# Altium project AMC_FMC_Carrier v3.PrjPcb (part 2 of 15)

## Sheet FPGA.SchDoc
size A3; DocumentNumber: 4; SheetNumber: 4; SheetTotal: 30
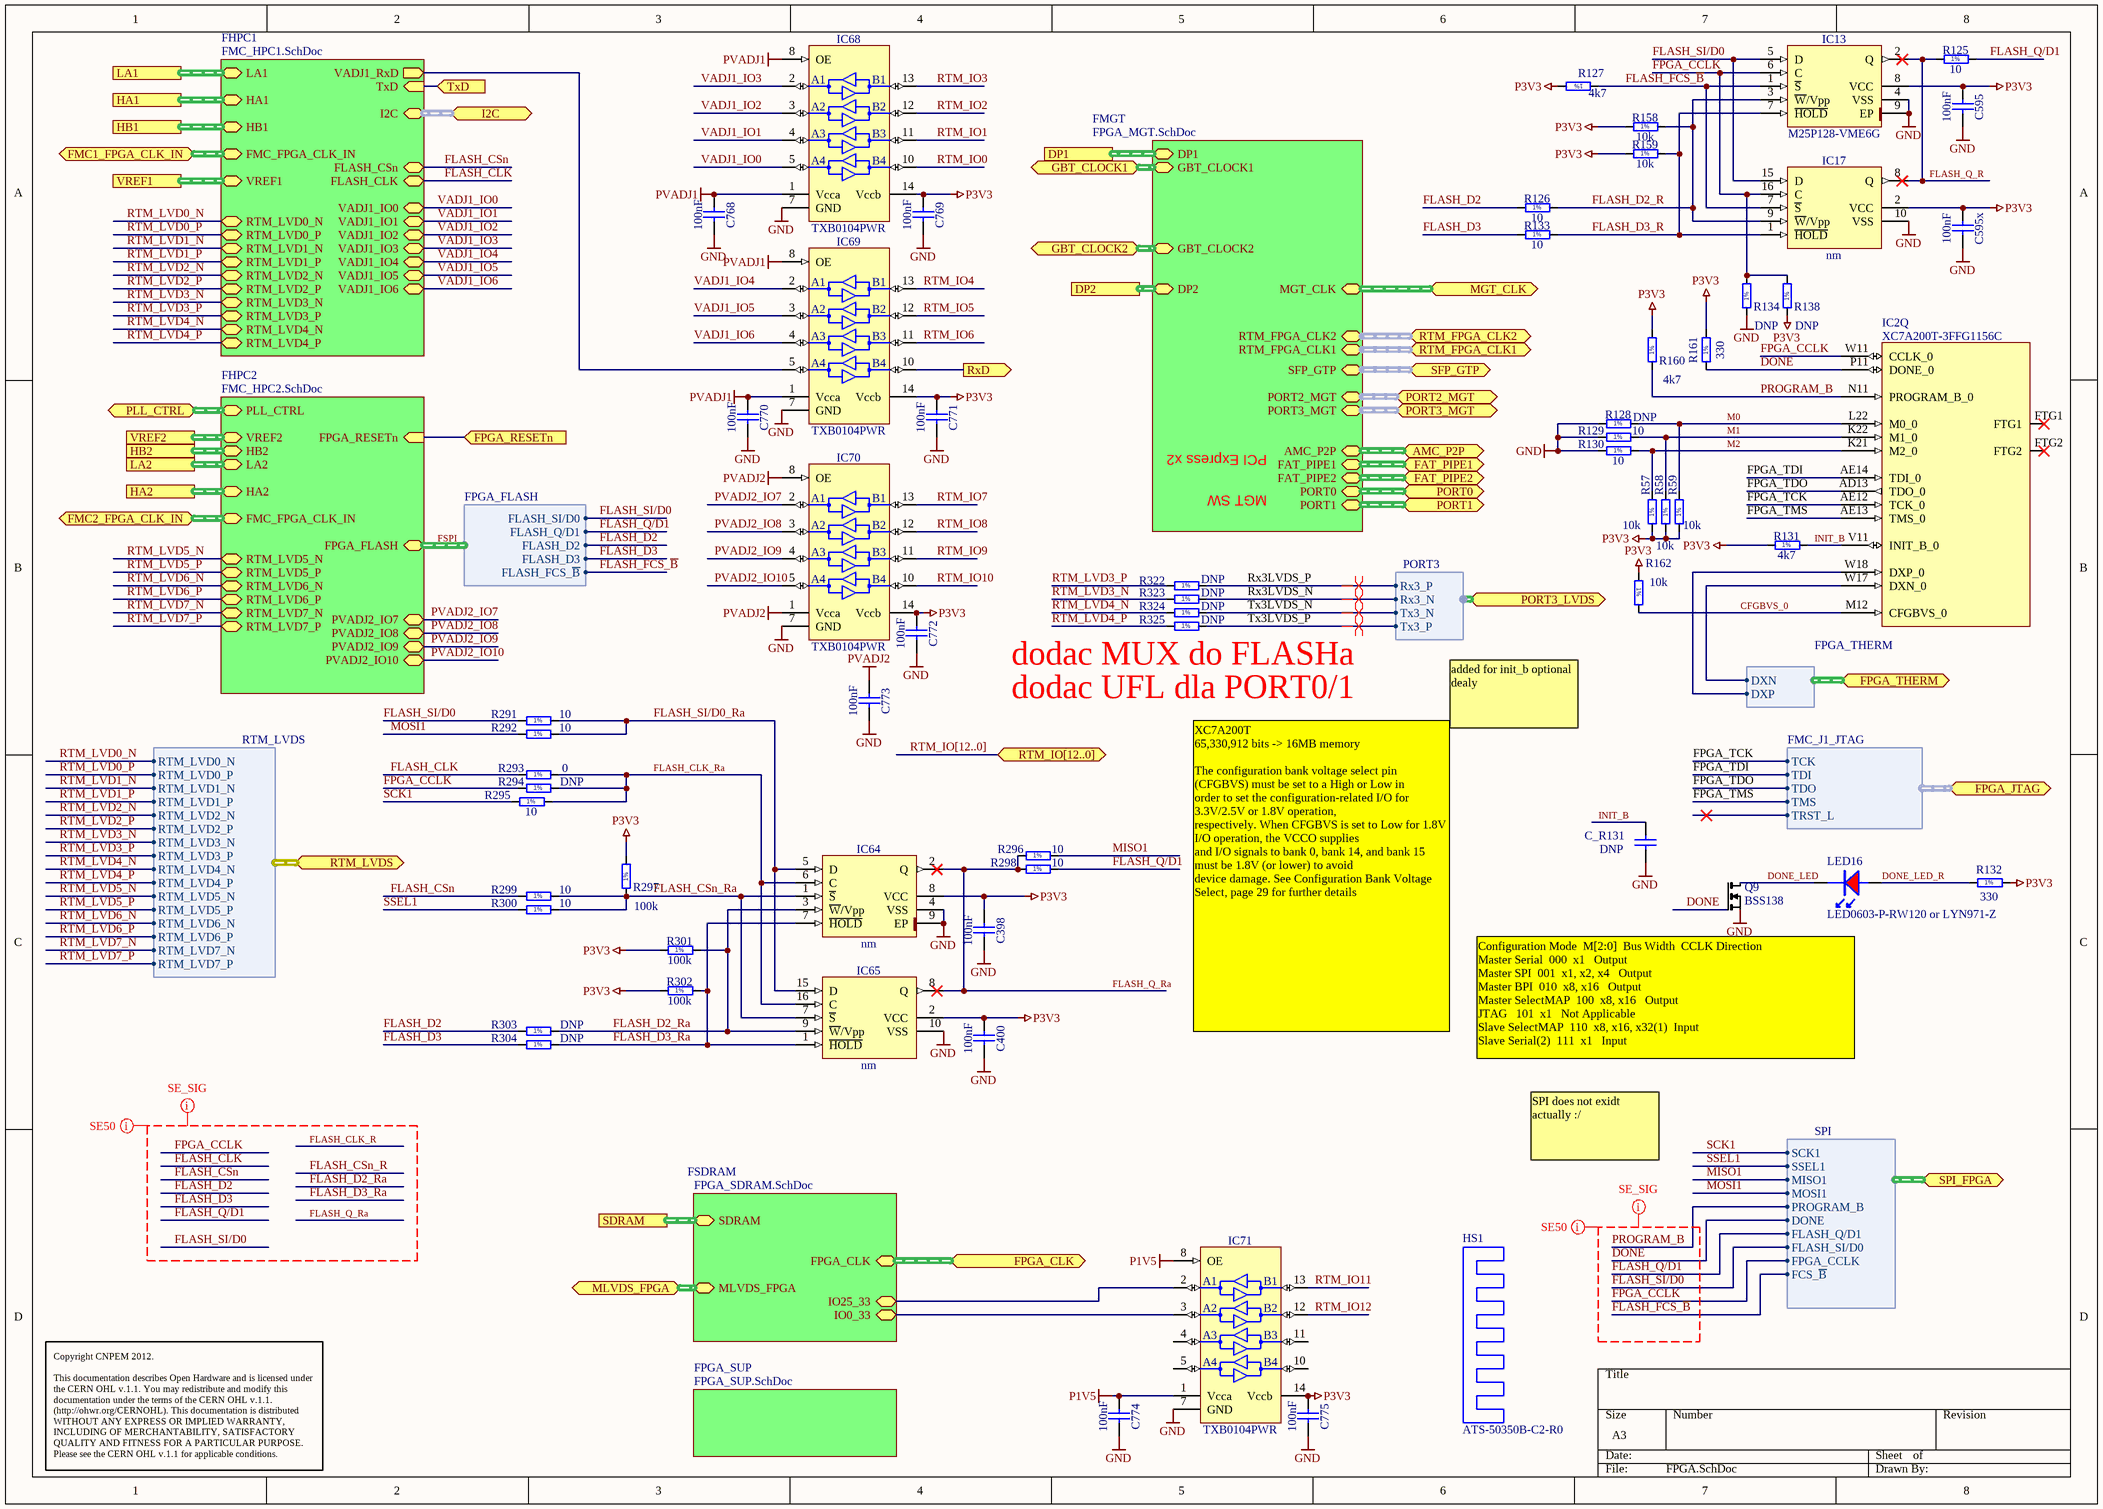
[diagram p4: FPGA.SchDoc]

### Parts
(Parts that share a designator on the sheet are numbered #1, #2 ... from top to bottom, then left to right.)
C398  100nF  [CAPC0603X33N]
C400  100nF  [CAPC0603X33N]
C595  100nF  [CAPC0603X33N]
C595x  100nF  [CAPC0603X33N]
C768  100nF  [CAPC0603X33N]
C769  100nF  [CAPC0603X33N]
C770  100nF  [CAPC0603X33N]
C771  100nF  [CAPC0603X33N]
C772  100nF  [CAPC0603X33N]
C773  100nF  [CAPC0603X33N]
C774  100nF  [CAPC0603X33N]
C775  100nF  [CAPC0603X33N]
C_R131  DNP  [CAPC1608X87N]
HS1  ATS-50350B-C2-R0  [HEAT_SINK_ATS-50350B-C2-R0]
IC2#1  XC7A200T-3FFG1156C  [BGA1156C100P34X34_3500X3500X335]  (part Q of 23)
IC13  M25P128-VME6G  [PSON127P800X600X100-9N-R640X480]
IC17  nm  [SOIC127P1030X265-16N]
IC64  nm  [PSON127P800X600X100-9N-R640X480]
IC65  nm  [SOIC127P1030X265-16N]
IC68  TXB0104PWR  [SOP65P640X120-14N]
IC69  TXB0104PWR  [SOP65P640X120-14N]
IC70  TXB0104PWR  [SOP65P640X120-14N]
IC71  TXB0104PWR  [SOP65P640X120-14N]
LED16  LED0603-P-RW120 or LYN971-Z  [led_0603R]
Q9  BSS138  [SOT95P251X112-3N]
R57  10k  [RESC1005X40N]
R58  10k  [RESC1005X40N]
R59  10k  [RESC1005X40N]
R125  10  [RESC1005X40N]
R126  10  [RESC1005X40N]
R127  4k7  [RESC1005X40N]
R128  DNP  [RESC1005X40N]
R129  10  [RESC1005X40N]
R130  10  [RESC1005X40N]
R131  4k7  [RESC1005X40N]
R132  330  [RESC1005X40N]
R133  10  [RESC1005X40N]
R134  DNP  [RESC1005X40N]
R138  DNP  [RESC1005X40N]
R158  10k  [RESC1005X40N]
R159  10k  [RESC1005X40N]
R160  4k7  [RESC1005X40N]
R161  330  [RESC1005X40N]
R162  10k  [RESC1005X40N]
R291  10  [RESC1005X40N]
R292  10  [RESC1005X40N]
R293  0  [RESC1005X40N]
R294  DNP  [RESC1005X40N]
R295  10  [RESC1005X40N]
R296  10  [RESC1005X40N]
R297  100k  [RESC1005X40N]
R298  10  [RESC1005X40N]
R299  10  [RESC1005X40N]
R300  10  [RESC1005X40N]
R301  100k  [RESC1005X40N]
R302  100k  [RESC1005X40N]
R303  DNP  [RESC1005X40N]
R304  DNP  [RESC1005X40N]
R322  DNP  [RESC1005X40N]
R323  DNP  [RESC1005X40N]
R324  DNP  [RESC1005X40N]
R325  DNP  [RESC1005X40N]

### Sub-sheets
FHPC1 = FMC_HPC1.SchDoc: LA1 (harness FMC_J1_LA), HA1 (harness FMC_J1_HA), HB1 (harness FMC_J1_HB), VREF1 (harness FMC_J1_VREF), FMC_FPGA_CLK_IN (harness FMC_FPGA_CLK_IN), I2C (harness I2C), FLASH_CLK, FLASH_CSn, VADJ1_RxD (out), TxD (in), VADJ1_IO0, VADJ1_IO1, VADJ1_IO2, VADJ1_IO3, VADJ1_IO4, VADJ1_IO5, VADJ1_IO6, RTM_LVD0_N (bidir), RTM_LVD0_P (bidir), RTM_LVD1_N (bidir), RTM_LVD1_P (bidir), RTM_LVD2_N (bidir), RTM_LVD2_P (bidir), RTM_LVD3_N (bidir), RTM_LVD3_P (bidir), RTM_LVD4_N (bidir), RTM_LVD4_P (bidir)
FHPC2 = FMC_HPC2.SchDoc: VREF2 (harness FMC_J1_VREF), HB2 (harness FMC_J1_HB), LA2 (harness FMC_J1_LA), HA2 (harness FMC_J1_HA), FPGA_FLASH (harness FPGA_FLASH), FMC_FPGA_CLK_IN (harness FMC_FPGA_CLK_IN), PLL_CTRL (harness PLL_CTRL), FPGA_RESETn (in), PVADJ2_IO7, PVADJ2_IO8, PVADJ2_IO9, PVADJ2_IO10, RTM_LVD5_N (bidir), RTM_LVD5_P (bidir), RTM_LVD6_N (bidir), RTM_LVD6_P (bidir), RTM_LVD7_N (bidir), RTM_LVD7_P (bidir)
FMGT = FPGA_MGT.SchDoc: DP1 (harness FMC_J1_DP), DP2 (harness FMC_J1_DP), FAT_PIPE1 (harness FAT_PIPE1), FAT_PIPE2 (harness FAT_PIPE2), PORT0 (harness PORT0), PORT1 (harness PORT1), GBT_CLOCK1 (harness GBT_CLOCK), GBT_CLOCK2 (harness GBT_CLOCK), MGT_CLK (harness MGT_CLK), PORT2_MGT, PORT3_MGT, SFP_GTP, RTM_FPGA_CLK2 (harness CLK_DIFF), RTM_FPGA_CLK1 (harness CLK_DIFF), AMC_P2P
FPGA_SUP = FPGA_SUP.SchDoc: no entries
FSDRAM = FPGA_SDRAM.SchDoc: SDRAM (harness DDR), MLVDS_FPGA (harness MLVDS-FPGA), FPGA_CLK (harness FPGA_SDRAM_CLK), IO25_33 (bidir), IO0_33 (bidir)

### Ports
AMC_P2P (harness AMC_P2P), DP1, DP2, FAT_PIPE1, FAT_PIPE2, FMC1_FPGA_CLK_IN, FMC2_FPGA_CLK_IN, FPGA_CLK, FPGA_JTAG (harness FMC_J1_JTAG), FPGA_RESETn (in), FPGA_THERM (harness FPGA_THERM), GBT_CLOCK1, GBT_CLOCK2, HA1, HA2, HB1, HB2, I2C (harness I2C), LA1, LA2, MGT_CLK, MLVDS_FPGA, PLL_CTRL (harness PLL_CTRL), PORT0, PORT1, PORT2_MGT (harness PORT2), PORT3_LVDS (harness PORT3), PORT3_MGT (harness PORT3), RTM_FPGA_CLK1 (harness CLK_DIFF), RTM_FPGA_CLK2 (harness CLK_DIFF), RTM_IO[12..0] (bidir), RTM_LVDS (harness RTM_LVDS), RxD (out), SDRAM (harness DDR), SFP_GTP (harness SFP_GTP), SPI_FPGA (harness SPI), TxD (in), VREF1 (harness FMC_J1_VREF), VREF2 (harness FMC_J1_VREF)

### Harnesses
FMC_J1_JTAG: TCK, TDI, TDO, TMS, TRST_L
FPGA_THERM: DXN, DXP
SPI: SCK1, SSEL1, MISO1, MOSI1, FLASH_Q/D1, FLASH_SI/D0, PROGRAM_B, DONE, FPGA_CCLK, FCS_~{B}
FPGA_FLASH: FLASH_FCS_~{B}, FLASH_D3, FLASH_D2, FLASH_Q/D1, FLASH_SI/D0
RTM_LVDS: RTM_LVD0_N, RTM_LVD0_P, RTM_LVD1_N, RTM_LVD1_P, RTM_LVD2_N, RTM_LVD2_P, RTM_LVD3_N, RTM_LVD3_P, RTM_LVD4_N, RTM_LVD4_P, RTM_LVD5_N, RTM_LVD5_P, RTM_LVD6_N, RTM_LVD6_P, RTM_LVD7_N, RTM_LVD7_P
PORT3: Rx3_P, Rx3_N, Tx3_N, Tx3_P

### Nets
GND: C398.2 C400.2 C595.2 C595x.2 C768.2 C769.2 C770.2 C771.2 C772.2 C773.2 C774.2 C775.2 C_R131.1 IC13.4(VSS) IC13.9(EP) IC17.10(VSS) IC64.4(VSS) IC64.9(EP) IC65.10(VSS) IC68.7(GND) IC69.7(GND) IC70.7(GND) IC71.7(GND) Q9.2(S) R128.1 R129.1 R130.1 R134.1
P1V5: C774.1 IC71.1(Vcca) IC71.8(OE)
P3V3: C398.1 C400.1 C595.1 C595x.1 C769.1 C771.1 C772.1 C775.1 IC13.8(VCC) IC17.2(VCC) IC64.8(VCC) IC65.2(VCC) IC68.14(Vccb) IC69.14(Vccb) IC70.14(Vccb) IC71.14(Vccb) R57.1 R58.1 R59.1 R127.2 R131.1 R132.2 R138.1 R158.1 R159.1 R160.2 R161.2 R162.1 R297.2 R301.1 R302.1
PVADJ1: C768.1 C770.1 IC68.1(Vcca) IC68.8(OE) IC69.1(Vcca) IC69.8(OE)
PVADJ2: C773.1 IC70.1(Vcca) IC70.8(OE)
CFGBVS_0: IC2#1.M12(CFGBVS_0) R162.2
DONE: IC2#1.P11(DONE_0) Q9.1(G) R161.1 ; port SPI_FPGA.DONE  [project net FSPI.DONE]
DONE_LED: LED16.K Q9.3(D)
DONE_LED_R: LED16.A R132.1
FLASH_CLK: R293.1 ; sheet FHPC1/FLASH_CLK
FLASH_CLK_Ra: IC64.6(C) IC65.16(C) R293.2 R294.2 R295.2
FLASH_CSn: R299.1 ; sheet FHPC1/FLASH_CSn
FLASH_CSn_Ra: IC64.1(~{S}) IC65.7(~{S}) R297.1 R299.2 R300.2
FLASH_D2: R126.1 R303.1 ; sheet FHPC2/FPGA_FLASH.FLASH_D2  [project net FSPI.FLASH_D2]
FLASH_D2_R: IC13.3(~{W}/Vpp) IC17.9(~{W}/Vpp) R126.2 R158.2
FLASH_D2_Ra: IC64.3(~{W}/Vpp) IC65.9(~{W}/Vpp) R301.2 R303.2
FLASH_D3: R133.1 R304.1 ; sheet FHPC2/FPGA_FLASH.FLASH_D3  [project net FSPI.FLASH_D3]
FLASH_D3_R: IC13.7(~{HOLD}) IC17.1(~{HOLD}) R133.2 R159.2
FLASH_D3_Ra: IC64.7(~{HOLD}) IC65.1(~{HOLD}) R302.2 R304.2
FLASH_FCS_~{B}: IC13.1(~{S}) IC17.7(~{S}) R127.1 ; port SPI_FPGA.FCS_~{B}, sheet FHPC2/FPGA_FLASH.FLASH_FCS_~{B}  [project net FSPI.FCS_~{B}]
FLASH_Q/D1: R125.2 R298.2 ; port SPI_FPGA.FLASH_Q/D1, sheet FHPC2/FPGA_FLASH.FLASH_Q/D1  [project net FSPI.FLASH_Q/D1]
FLASH_Q_R: IC13.2(Q) IC17.8(Q) R125.1
FLASH_Q_Ra: IC64.2(Q) IC65.8(Q) R296.1 R298.1
FLASH_SI/D0: IC13.5(D) IC17.15(D) R291.1 ; port SPI_FPGA.FLASH_SI/D0, sheet FHPC2/FPGA_FLASH.FLASH_SI/D0  [project net FSPI.FLASH_SI/D0]
FLASH_SI/D0_Ra: IC64.5(D) IC65.15(D) R291.2 R292.2
FPGA_CCLK: IC2#1.W11(CCLK_0) IC13.6(C) IC17.16(C) R134.2 R138.2 R294.1 ; port SPI_FPGA.FPGA_CCLK  [project net FSPI.FPGA_CCLK]
FPGA_RESETn: port FPGA_RESETn, sheet FHPC2/FPGA_RESETn
FPGA_TCK: IC2#1.AE12(TCK_0) ; port FPGA_JTAG.TCK  [project net FJTAG.TCK]
FPGA_TDI: IC2#1.AE14(TDI_0) ; port FPGA_JTAG.TDI  [project net FJTAG.TDI]
FPGA_TDO: IC2#1.AD13(TDO_0) ; port FPGA_JTAG.TDO  [project net FJTAG.TDO]
FPGA_TMS: IC2#1.AE13(TMS_0) ; port FPGA_JTAG.TMS  [project net FJTAG.TMS]
FTMP.DXN: IC2#1.W17(DXN_0) ; port FPGA_THERM.DXN
FTMP.DXP: IC2#1.W18(DXP_0) ; port FPGA_THERM.DXP
INIT_B: C_R131.2 IC2#1.V11(INIT_B_0) R131.2
IO0_33: IC71.3(A2) ; sheet FSDRAM/IO0_33
IO25_33: IC71.2(A1) ; sheet FSDRAM/IO25_33
M0: IC2#1.L22(M0_0) R59.2 R128.2
M1: IC2#1.K22(M1_0) R58.2 R129.2
M2: IC2#1.K21(M2_0) R57.2 R130.2
MISO1: R296.2 ; port SPI_FPGA.MISO1  [project net FSPI.MISO1]
MOSI1: R292.1 ; port SPI_FPGA.MOSI1  [project net FSPI.MOSI1]
PROGRAM_B: IC2#1.N11(PROGRAM_B_0) R160.1 ; port SPI_FPGA.PROGRAM_B  [project net FSPI.PROGRAM_B]
PVADJ2_IO7: IC70.2(A1) ; sheet FHPC2/PVADJ2_IO7
PVADJ2_IO8: IC70.3(A2) ; sheet FHPC2/PVADJ2_IO8
PVADJ2_IO9: IC70.4(A3) ; sheet FHPC2/PVADJ2_IO9
PVADJ2_IO10: IC70.5(A4) ; sheet FHPC2/PVADJ2_IO10
RTM_IO0: IC68.10(B4)
RTM_IO1: IC68.11(B3)
RTM_IO2: IC68.12(B2)
RTM_IO3: IC68.13(B1)
RTM_IO4: IC69.13(B1)
RTM_IO5: IC69.12(B2)
RTM_IO6: IC69.11(B3)
RTM_IO7: IC70.13(B1)
RTM_IO8: IC70.12(B2)
RTM_IO9: IC70.11(B3)
RTM_IO10: IC70.10(B4)
RTM_IO11: IC71.13(B1)
RTM_IO12: IC71.12(B2)
RTM_LVD0_N: sheet FHPC1/RTM_LVD0_N, port RTM_LVDS.RTM_LVD0_N  [project net RTM_LVDS.RTM_LVD0_N]
RTM_LVD0_P: sheet FHPC1/RTM_LVD0_P, port RTM_LVDS.RTM_LVD0_P  [project net RTM_LVDS.RTM_LVD0_P]
RTM_LVD1_N: sheet FHPC1/RTM_LVD1_N, port RTM_LVDS.RTM_LVD1_N  [project net RTM_LVDS.RTM_LVD1_N]
RTM_LVD1_P: sheet FHPC1/RTM_LVD1_P, port RTM_LVDS.RTM_LVD1_P  [project net RTM_LVDS.RTM_LVD1_P]
RTM_LVD2_N: sheet FHPC1/RTM_LVD2_N, port RTM_LVDS.RTM_LVD2_N  [project net RTM_LVDS.RTM_LVD2_N]
RTM_LVD2_P: sheet FHPC1/RTM_LVD2_P, port RTM_LVDS.RTM_LVD2_P  [project net RTM_LVDS.RTM_LVD2_P]
RTM_LVD3_N: R323.1 ; sheet FHPC1/RTM_LVD3_N, port RTM_LVDS.RTM_LVD3_N  [project net RTM_LVDS.RTM_LVD3_N]
RTM_LVD3_P: R322.1 ; sheet FHPC1/RTM_LVD3_P, port RTM_LVDS.RTM_LVD3_P  [project net RTM_LVDS.RTM_LVD3_P]
RTM_LVD4_N: R324.1 ; sheet FHPC1/RTM_LVD4_N, port RTM_LVDS.RTM_LVD4_N  [project net RTM_LVDS.RTM_LVD4_N]
RTM_LVD4_P: R325.1 ; sheet FHPC1/RTM_LVD4_P, port RTM_LVDS.RTM_LVD4_P  [project net RTM_LVDS.RTM_LVD4_P]
RTM_LVD5_N: sheet FHPC2/RTM_LVD5_N, port RTM_LVDS.RTM_LVD5_N  [project net RTM_LVDS.RTM_LVD5_N]
RTM_LVD5_P: sheet FHPC2/RTM_LVD5_P, port RTM_LVDS.RTM_LVD5_P  [project net RTM_LVDS.RTM_LVD5_P]
RTM_LVD6_N: sheet FHPC2/RTM_LVD6_N, port RTM_LVDS.RTM_LVD6_N  [project net RTM_LVDS.RTM_LVD6_N]
RTM_LVD6_P: sheet FHPC2/RTM_LVD6_P, port RTM_LVDS.RTM_LVD6_P  [project net RTM_LVDS.RTM_LVD6_P]
RTM_LVD7_N: sheet FHPC2/RTM_LVD7_N, port RTM_LVDS.RTM_LVD7_N  [project net RTM_LVDS.RTM_LVD7_N]
RTM_LVD7_P: sheet FHPC2/RTM_LVD7_P, port RTM_LVDS.RTM_LVD7_P  [project net RTM_LVDS.RTM_LVD7_P]
Rx3LVDS_N: R323.2 ; port PORT3_LVDS.Rx3_N  [project net PORT3_LVDS.Rx3_N]
Rx3LVDS_P: R322.2 ; port PORT3_LVDS.Rx3_P  [project net PORT3_LVDS.Rx3_P]
RxD_USB: IC69.10(B4) ; port RxD
SCK1: R295.1 ; port SPI_FPGA.SCK1  [project net FSPI.SCK1]
SSEL1: R300.1 ; port SPI_FPGA.SSEL1  [project net FSPI.SSEL1]
Tx3LVDS_N: R324.2 ; port PORT3_LVDS.Tx3_N  [project net PORT3_LVDS.Tx3_N]
Tx3LVDS_P: R325.2 ; port PORT3_LVDS.Tx3_P  [project net PORT3_LVDS.Tx3_P]
TxD_USB: port TxD, sheet FHPC1/TxD
VADJ1_IO0: IC68.5(A4) ; sheet FHPC1/VADJ1_IO0
VADJ1_IO1: IC68.4(A3) ; sheet FHPC1/VADJ1_IO1
VADJ1_IO2: IC68.3(A2) ; sheet FHPC1/VADJ1_IO2
VADJ1_IO3: IC68.2(A1) ; sheet FHPC1/VADJ1_IO3
VADJ1_IO4: IC69.2(A1) ; sheet FHPC1/VADJ1_IO4
VADJ1_IO5: IC69.3(A2) ; sheet FHPC1/VADJ1_IO5
VADJ1_IO6: IC69.4(A3) ; sheet FHPC1/VADJ1_IO6
VADJ1_RxD: IC69.5(A4) ; sheet FHPC1/VADJ1_RxD

Not connected (* = marked no-connect by the designer): IC2#1 FTG1* FTG2*; IC71 4(A3) 5(A4) 10(B4) 11(B3)

### Buses and harness runs
bus RTM_IO[12..0] = port RTM_IO[12..0]
harness FSPI = sheet FHPC2/FPGA_FLASH
harness port AMC_P2P = sheet FMGT/AMC_P2P
harness port DP1 = sheet FMGT/DP1
harness port DP2 = sheet FMGT/DP2
harness port FAT_PIPE1 = sheet FMGT/FAT_PIPE1
harness port FAT_PIPE2 = sheet FMGT/FAT_PIPE2
harness port FMC1_FPGA_CLK_IN = sheet FHPC1/FMC_FPGA_CLK_IN
harness port FMC2_FPGA_CLK_IN = sheet FHPC2/FMC_FPGA_CLK_IN
harness port FPGA_CLK = sheet FSDRAM/FPGA_CLK
harness port GBT_CLOCK1 = sheet FMGT/GBT_CLOCK1
harness port GBT_CLOCK2 = sheet FMGT/GBT_CLOCK2
harness port HA1 = sheet FHPC1/HA1
harness port HA2 = sheet FHPC2/HA2
harness port HB1 = sheet FHPC1/HB1
harness port HB2 = sheet FHPC2/HB2
harness port I2C = sheet FHPC1/I2C
harness port LA1 = sheet FHPC1/LA1
harness port LA2 = sheet FHPC2/LA2
harness port MGT_CLK = sheet FMGT/MGT_CLK
harness port MLVDS_FPGA = sheet FSDRAM/MLVDS_FPGA
harness port PLL_CTRL = sheet FHPC2/PLL_CTRL
harness port PORT0 = sheet FMGT/PORT0
harness port PORT1 = sheet FMGT/PORT1
harness port PORT2_MGT = sheet FMGT/PORT2_MGT
harness port PORT3_MGT = sheet FMGT/PORT3_MGT
harness port RTM_FPGA_CLK1 = sheet FMGT/RTM_FPGA_CLK1
harness port RTM_FPGA_CLK2 = sheet FMGT/RTM_FPGA_CLK2
harness port SDRAM = sheet FSDRAM/SDRAM
harness port SFP_GTP = sheet FMGT/SFP_GTP
harness port VREF1 = sheet FHPC1/VREF1
harness port VREF2 = sheet FHPC2/VREF2

### Layout directives
net class SE_SIG: DONE, FLASH_CLK, FLASH_CLK_R, FLASH_CSn, FLASH_CSn_R, FLASH_D2, FLASH_D2_Ra, FLASH_D3, FLASH_D3_Ra, FLASH_FCS_~{B}, FLASH_Q/D1, FLASH_Q_Ra, FLASH_SI/D0, FPGA_CCLK, PROGRAM_B
net class SE50: DONE, FLASH_CLK, FLASH_CLK_R, FLASH_CSn, FLASH_CSn_R, FLASH_D2, FLASH_D2_Ra, FLASH_D3, FLASH_D3_Ra, FLASH_FCS_~{B}, FLASH_Q/D1, FLASH_Q_Ra, FLASH_SI/D0, FPGA_CCLK, PROGRAM_B
differential pair: PORT3_LVDS.Rx3_N, PORT3_LVDS.Rx3_P, PORT3_LVDS.Tx3_N, PORT3_LVDS.Tx3_P

### Notes on the sheet
- PCI Express x2
- MGT SW
- (near R325) dodac MUX do FLASHa
- dodac UFL dla PORT0/1
- added for init_b optional dealy
- XC7A200T
  65,330,912 bits -> 16MB memory
  The configuration bank voltage select pin (CFGBVS) must be set to a High or Low in
  order to set the configuration-related I/O for 3.3V/2.5V or 1.8V operation,
  respectively. When CFGBVS is set to Low for 1.8V I/O operation, the VCCO supplies
  and I/O signals to bank 0, bank 14, and bank 15 must be 1.8V (or lower) to avoid
  device damage. See Configuration Bank Voltage Select, page 29 for further details
- (near Q9) Configuration Mode 	M[2:0] 	Bus Width 	CCLK Direction
  Master Serial 	000 	x1 		Output
  Master SPI 	001 	x1, x2, x4 		Output
  Master BPI 	010 	x8, x16 		Output
  Master SelectMAP 	100 	x8, x16 		Output
  JTAG 		101 	x1 		Not Applicable
  Slave SelectMAP 	110	 x8, x16, x32(1) 	Input
  Slave Serial(2) 	111 	x1 		Input
- SPI does not exidt actually :/
- Copyright CNPEM 2012.
  This documentation describes Open Hardware and is licensed under the CERN OHL v.1.1. You may redistribute and modify this documentation under the terms of the CERN OHL v.1.1. (http://ohwr.org/CERNOHL). This documentation is distributed WITHOUT ANY EXPRESS OR IMPLIED WARRANTY, INCLUDING OF MERCHANTABILITY, SATISFACTORY QUALITY AND FITNESS FOR A PARTICULAR PURPOSE. Please see the CERN OHL v.1.1 for applicable conditions.
- (in symbol R0402_0R_JUMPER) 1%
- (in symbol R0402_4K7_1%_0.0625W_100PPM) 1%
- (in symbol R0402_10K_1%_0.0625W_100PPM) 1%
- (in symbol R0402_10R_1%_0.0625W_200PPM) 1%
- (in symbol R0402_100K_1%_0.0625W_100PPM) 1%
- (in symbol R0402_100R_1%_0.0625W_100PPM) 1%
- (in symbol R0402_330R_1%_0.0625W_100PPM) 1%

### Library data of the parts
C398 C400 C595 C595x C768-C775 = CC0201_100NF_6.3V_10%_X5R: Non-polarised capacitor; Part Description: SMD Multilayer Chip Ceramic Capacitor; Manufacturer: GENERIC; Manufacturer1 Part Number: 02016D104KAT2A; Voltage: 6.3V; TC: X5R; Tolerance: ±10%; Table: Capacitors SMD; Part Number: CC0201_100NF_6.3V_10%_X5R; Component Kind: Standard; Component Type: Standard; Pin Count: 2; Value: 100nF; Status: Not Recommended; Manufacturer Part Number: CC0201_100NF_6.3V_10%_X5R; Case: 0201; Mounted: Yes; Socket: No; SMD: Yes; Manufacturer1 Example: AVX; Manufacturer1 ComponentHeight: 0.33mm; HelpURL: \\cern.ch\dfs\Applications\Altium\Datasheets\CC0201_X5R_AVX.pdf; Author: CERN DEM JLC; CreateDate: 2007-12-03; LatestRevisionDate: 2007-12-03
C_R131 = CC0603_1UF_16V_10%_X7R: Non-polarised capacitor; Part Description: SMD Multilayer Chip Ceramic Capacitor; Manufacturer: GENERIC; Manufacturer1 Part Number: 223824613663; Value: 1uF; Voltage: 16V; TC: X7R; Tolerance: ±10%; Table: Capacitors SMD; Part Number: CC0603_1UF_16V_10%_X7R; Component Kind: Standard; Component Type: Standard; Pin Count: 2; Status: Preferred; Manufacturer Part Number: CC0603_1uF_16V_10%_X7R; Case: 0603; Mounted: Yes; Socket: No; SMD: Yes; Manufacturer1 Example: PHYCOMP; Manufacturer1 ComponentHeight: 0.87mm; HelpURL: \\cern.ch\dfs\Applications\Altium\Datasheets\CC0805_X5R_PHYCOMP_HC.pdf; Author: CERN DEM JLC; CreateDate: 2007-12-03; LatestRevisionDate: 2007-12-03
HS1 = HEAT_SINK_ATS-50350B-C2-R0: Heat sink BGA 35x35(44.9)mm
IC2#1 = XC7A350T-2FFG1156C: Artix-6 FPGA, 16 GTPs, 600 User I/Os, 1156-Pin BGA, Speed Grade 2, Commercial Grade, Pb-Free; Part Description: Artix-7 FPGA, 16 GTPs, 600 User I/Os, 1156-Pin BGA, Speed Grade 2, Commercial Grade, Pb-Free; Manufacturer: XILINX; Table: Logic; Part Number: XC7A200T-3FFG1156C; Component Kind: Standard; Component Type: Standard; Device: XC7A200T-3FFG1156C; PackageDescription: BGA, 1.00mm Pitch, Square; 1156 Pin, 34 Columns X 34 Rows, 35.00mm X 35.00mm X 3.350mm H; Manufacturer Part Number: XC7A200T-3FFG1156C; Pin Count: 1156; Case: BGA1156; Mounted: Yes; Socket: No; SMD: Yes; ComponentHeight: 3.35mm; HelpURL: \\cern.ch\dfs\Applications\Altium\Datasheets\XC7A350T-2FFG1156C.pdf; ComponentLink1URL: \\cern.ch\dfs\Applications\Altium\Datasheets\XC7A350T-2FFG1156C.pdf; ComponentLink1Description: Package/Pinout; Author: CERN DEM JLC; CreateDate: 2012-09-19; LatestRevisionDate: 2012-09-19
IC13 IC64 = M25P128-VME6G: 128 Mbit (Multilevel), low-voltage, Serial Flash memory with 50-MHz SPI bus interface; Manufacturer: NUMONYX; Table: Logic; Part Number: M25P128-VME6G; Component Kind: Standard; Component Type: Standard; Device: M25P128-VME6G; PackageDescription: SON,1.27mm,pitch; 8 pin,8.00mm W X 6.00mm L X 1.00mm H body (w/pullback leads,thermal tab 6.4 X 4.8mm), IPC Medium Density; Part Description: 128 Mbit (Multilevel), Low-Voltage, Serial Flash Memory With 50-MHz SPI Bus Interface; Manufacturer Part Number: M25P128-VME6G; Pin Count: 9; Case: SON8; Mounted: Yes; Socket: No; SMD: Yes; ComponentHeight: 1mm; HelpURL: \\cern.ch\dfs\Applications\Altium\Datasheets\M25P128-VME6G.pdf; Author: CERN DEM JLC; CreateDate: 2010-01-20; LatestRevisionDate: 2010-01-20
IC17 IC65 = M25P128-VMF6G: 128 Mbit (Multilevel), low-voltage, Serial Flash memory with 50-MHz SPI bus interface; Manufacturer: NUMONYX; Table: Logic; Part Number: M25P128-VMF6G; Component Kind: Standard; Component Type: Standard; Device: M25P128-VMF6G; PackageDescription: SOIC 16, Pitch 1.27mm - Body 7.5x10.3mm, IPC Medium Density; Part Description: 128 Mbit (Multilevel), Low-Voltage, Serial Flash Memory With 50-MHz SPI Bus Interface; Manufacturer Part Number: M25P128-VMF6G; Pin Count: 8; Case: SOIC16; Mounted: Yes; Socket: No; SMD: Yes; ComponentHeight: 2.65mm; HelpURL: \\cern.ch\dfs\Applications\Altium\Datasheets\M25P128-VMF6G.pdf; Author: CERN DEM JLC; CreateDate: 2010-01-20; LatestRevisionDate: 2010-10-21
IC68-IC71 = TXB0104PWR: 4-Bit Bidirectionnal Voltage-Level Translator; Part Description: 4-Bit Bidirectional Voltage-Level Translator with Automatic Direction Sensing and ±15kV ESD Protection; Manufacturer: TEXAS INSTRUMENTS; Table: Analog & Interface; Part Number: TXB0104PWR; Component Kind: Standard; Component Type: Standard; Device: TXB0104PWR; PackageDescription: SOP, 14-Leads, Body 5.1x4.5mm (max), Pitch 0.65mm, IPC Medium Density; Manufacturer Part Number: TXB0104PWR; Pin Count: 14; Case: TSSOP14; Mounted: Yes; Socket: No; SMD: Yes; ComponentHeight: 1.2mm; Author: CERN DEM JMW; HelpURL: \\cern.ch\dfs\Applications\Altium\Datasheets\TXB0104PWR.pdf; CreateDate: 2010-12-20; LatestRevisionDate: 2010-12-20
LED16 = LED_0603R: LED 0603 red; Supplier 1: Newark; Supplier Part Number 1: 22M3004; Supplier 2: Newark; Supplier Part Number 2: 20M0618
Q9 = Q_BSS138
R57-R59 R158 R159 R162 = R0402_10K_1%_0.0625W_100PPM: Resistor - 1%; Part Description: General Purpose Thick Film Chip Resistor; Manufacturer: GENERIC; Manufacturer1 Part Number: 232270671003L; TC: ±100ppm/°C; Table: Resistors SMD; Part Number: R0402_10K_1%_0.0625W_100PPM; Component Kind: Standard; Component Type: Standard; Pin Count: 2; Value: 10k; Status: Not recommended; Power: 0.0625W; Tolerance: ±1%; Manufacturer Part Number: R0402_10K_1%_0.0625W_100PPM; Case: 0402; Mounted: Yes; Socket: No; SMD: Yes; Manufacturer1 Example: YAGEO PHYCOMP; Manufacturer1 ComponentHeight: 0.4mm; HelpURL: \\cern.ch\dfs\Applications\Altium\Datasheets\R0402_Phycomp_RC0402.pdf; Author: CERN DEM JLC; CreateDate: 2007-12-03; LatestRevisionDate: 2012-10-17
R125 R126 R129 R130 R133 R291 R292 R295 R296 R298-R300 = R0402_10R_1%_0.0625W_200PPM: Resistor - 1%; Part Description: General Purpose Thick Film Chip Resistor; Manufacturer: GENERIC; Manufacturer1 Part Number: 232270671009L; TC: ±200ppm/°C; Table: Resistors SMD; Part Number: R0402_10R_1%_0.0625W_200PPM; Component Kind: Standard; Component Type: Standard; Pin Count: 2; Value: 10; Status: Not recommended; Power: 0.0625W; Tolerance: ±1%; Manufacturer Part Number: R0402_10R_1%_0.0625W_200PPM; Case: 0402; Mounted: Yes; Socket: No; SMD: Yes; Manufacturer1 Example: YAGEO PHYCOMP; Manufacturer1 ComponentHeight: 0.4mm; HelpURL: \\cern.ch\dfs\Applications\Altium\Datasheets\R0402_Phycomp_RC0402.pdf; Author: CERN DEM JLC; CreateDate: 2009-06-24; LatestRevisionDate: 2012-10-17
R127 R131 R160 = R0402_4K7_1%_0.0625W_100PPM: Resistor - 1%; Part Description: General Purpose Thick Film Chip Resistor; Manufacturer: GENERIC; Manufacturer1 Part Number: 232270674702L; TC: ±100ppm/°C; Table: Resistors SMD; Part Number: R0402_4K7_1%_0.0625W_100PPM; Component Kind: Standard; Component Type: Standard; Pin Count: 2; Value: 4k7; Status: Not recommended; Power: 0.0625W; Tolerance: ±1%; Manufacturer Part Number: R0402_4K7_1%_0.0625W_100PPM; Case: 0402; Mounted: Yes; Socket: No; SMD: Yes; Manufacturer1 Example: YAGEO PHYCOMP; Manufacturer1 ComponentHeight: 0.4mm; HelpURL: \\cern.ch\dfs\Applications\Altium\Datasheets\R0402_Phycomp_RC0402.pdf; Author: CERN DEM JLC; CreateDate: 2007-12-03; LatestRevisionDate: 2012-10-17
R128 R294 R303 R304 R322-R325 = R0402_0R_JUMPER: Resistor - 1%; Part Description: 1A (0.05R Max DC Resistance) Zero Ohm Jumper; Manufacturer: GENERIC; Manufacturer1 Part Number: 232270591001L; Value: 0; Table: Resistors SMD; Part Number: R0402_0R_JUMPER; Component Kind: Standard; Component Type: Standard; Pin Count: 2; Status: Not recommended; Manufacturer Part Number: R0402_0R_JUMPER; Case: 0402; Mounted: Yes; Socket: No; SMD: Yes; Manufacturer1 Example: YAGEO PHYCOMP; Manufacturer1 ComponentHeight: 0.4mm; HelpURL: \\cern.ch\dfs\Applications\Altium\Datasheets\R0402_Phycomp_RC0402.pdf; Author: CERN DEM JLC; CreateDate: 2007-12-03; LatestRevisionDate: 2012-10-17
R132 R161 = R0402_330R_1%_0.0625W_100PPM: Resistor - 1%; Part Description: General Purpose Thick Film Chip Resistor; Manufacturer: GENERIC; Manufacturer1 Part Number: 232270673301L; TC: ±100ppm/°C; Table: Resistors SMD; Part Number: R0402_330R_1%_0.0625W_100PPM; Component Kind: Standard; Component Type: Standard; Pin Count: 2; Value: 330; Status: Not recommended; Power: 0.0625W; Tolerance: ±1%; Manufacturer Part Number: R0402_330R_1%_0.0625W_100PPM; Case: 0402; Mounted: Yes; Socket: No; SMD: Yes; Manufacturer1 Example: YAGEO PHYCOMP; Manufacturer1 ComponentHeight: 0.4mm; HelpURL: \\cern.ch\dfs\Applications\Altium\Datasheets\R0402_Phycomp_RC0402.pdf; Author: CERN DEM JLC; CreateDate: 2007-12-03; LatestRevisionDate: 2012-10-17
R134 R138 = R0402_100R_1%_0.0625W_100PPM: Resistor - 1%; Part Description: General Purpose Thick Film Chip Resistor; Manufacturer: GENERIC; Manufacturer1 Part Number: 232270671001L; Value: 100; TC: ±100ppm/°C; Table: Resistors SMD; Part Number: R0402_100R_1%_0.0625W_100PPM; Component Kind: Standard; Component Type: Standard; Pin Count: 2; Status: Not recommended; Power: 0.0625W; Tolerance: ±1%; Manufacturer Part Number: R0402_100R_1%_0.0625W_100PPM; Case: 0402; Mounted: Yes; Socket: No; SMD: Yes; Manufacturer1 Example: YAGEO PHYCOMP; Manufacturer1 ComponentHeight: 0.4mm; HelpURL: \\cern.ch\dfs\Applications\Altium\Datasheets\R0402_Phycomp_RC0402.pdf; Author: CERN DEM JLC; CreateDate: 2007-12-03; LatestRevisionDate: 2012-10-17
R293 = R0402_0R_JUMPER: Resistor - 1%; Part Description: 1A (0.05R Max DC Resistance) Zero Ohm Jumper; Manufacturer: GENERIC; Manufacturer1 Part Number: 232270591001L; Table: Resistors SMD; Part Number: R0402_0R_JUMPER; Component Kind: Standard; Component Type: Standard; Pin Count: 2; Value: 0; Status: Not recommended; Manufacturer Part Number: R0402_0R_JUMPER; Case: 0402; Mounted: Yes; Socket: No; SMD: Yes; Manufacturer1 Example: YAGEO PHYCOMP; Manufacturer1 ComponentHeight: 0.4mm; HelpURL: \\cern.ch\dfs\Applications\Altium\Datasheets\R0402_Phycomp_RC0402.pdf; Author: CERN DEM JLC; CreateDate: 2007-12-03; LatestRevisionDate: 2012-10-17
R297 R301 R302 = R0402_100K_1%_0.0625W_100PPM: Resistor - 1%; Part Description: General Purpose Thick Film Chip Resistor; Manufacturer: GENERIC; Manufacturer1 Part Number: 232270671004L; TC: ±100ppm/°C; Table: Resistors SMD; Part Number: R0402_100K_1%_0.0625W_100PPM; Component Kind: Standard; Component Type: Standard; Pin Count: 2; Value: 100k; Status: Not recommended; Power: 0.0625W; Tolerance: ±1%; Manufacturer Part Number: R0402_100K_1%_0.0625W_100PPM; Case: 0402; Mounted: Yes; Socket: No; SMD: Yes; Manufacturer1 Example: YAGEO PHYCOMP; Manufacturer1 ComponentHeight: 0.4mm; HelpURL: \\cern.ch\dfs\Applications\Altium\Datasheets\R0402_Phycomp_RC0402.pdf; Author: CERN DEM JLC; CreateDate: 2007-12-03; LatestRevisionDate: 2012-10-17

## Sheet FPGA_SDRAM.SchDoc
size A3; DocumentNumber: 18; SheetNumber: 18; SheetTotal: 30
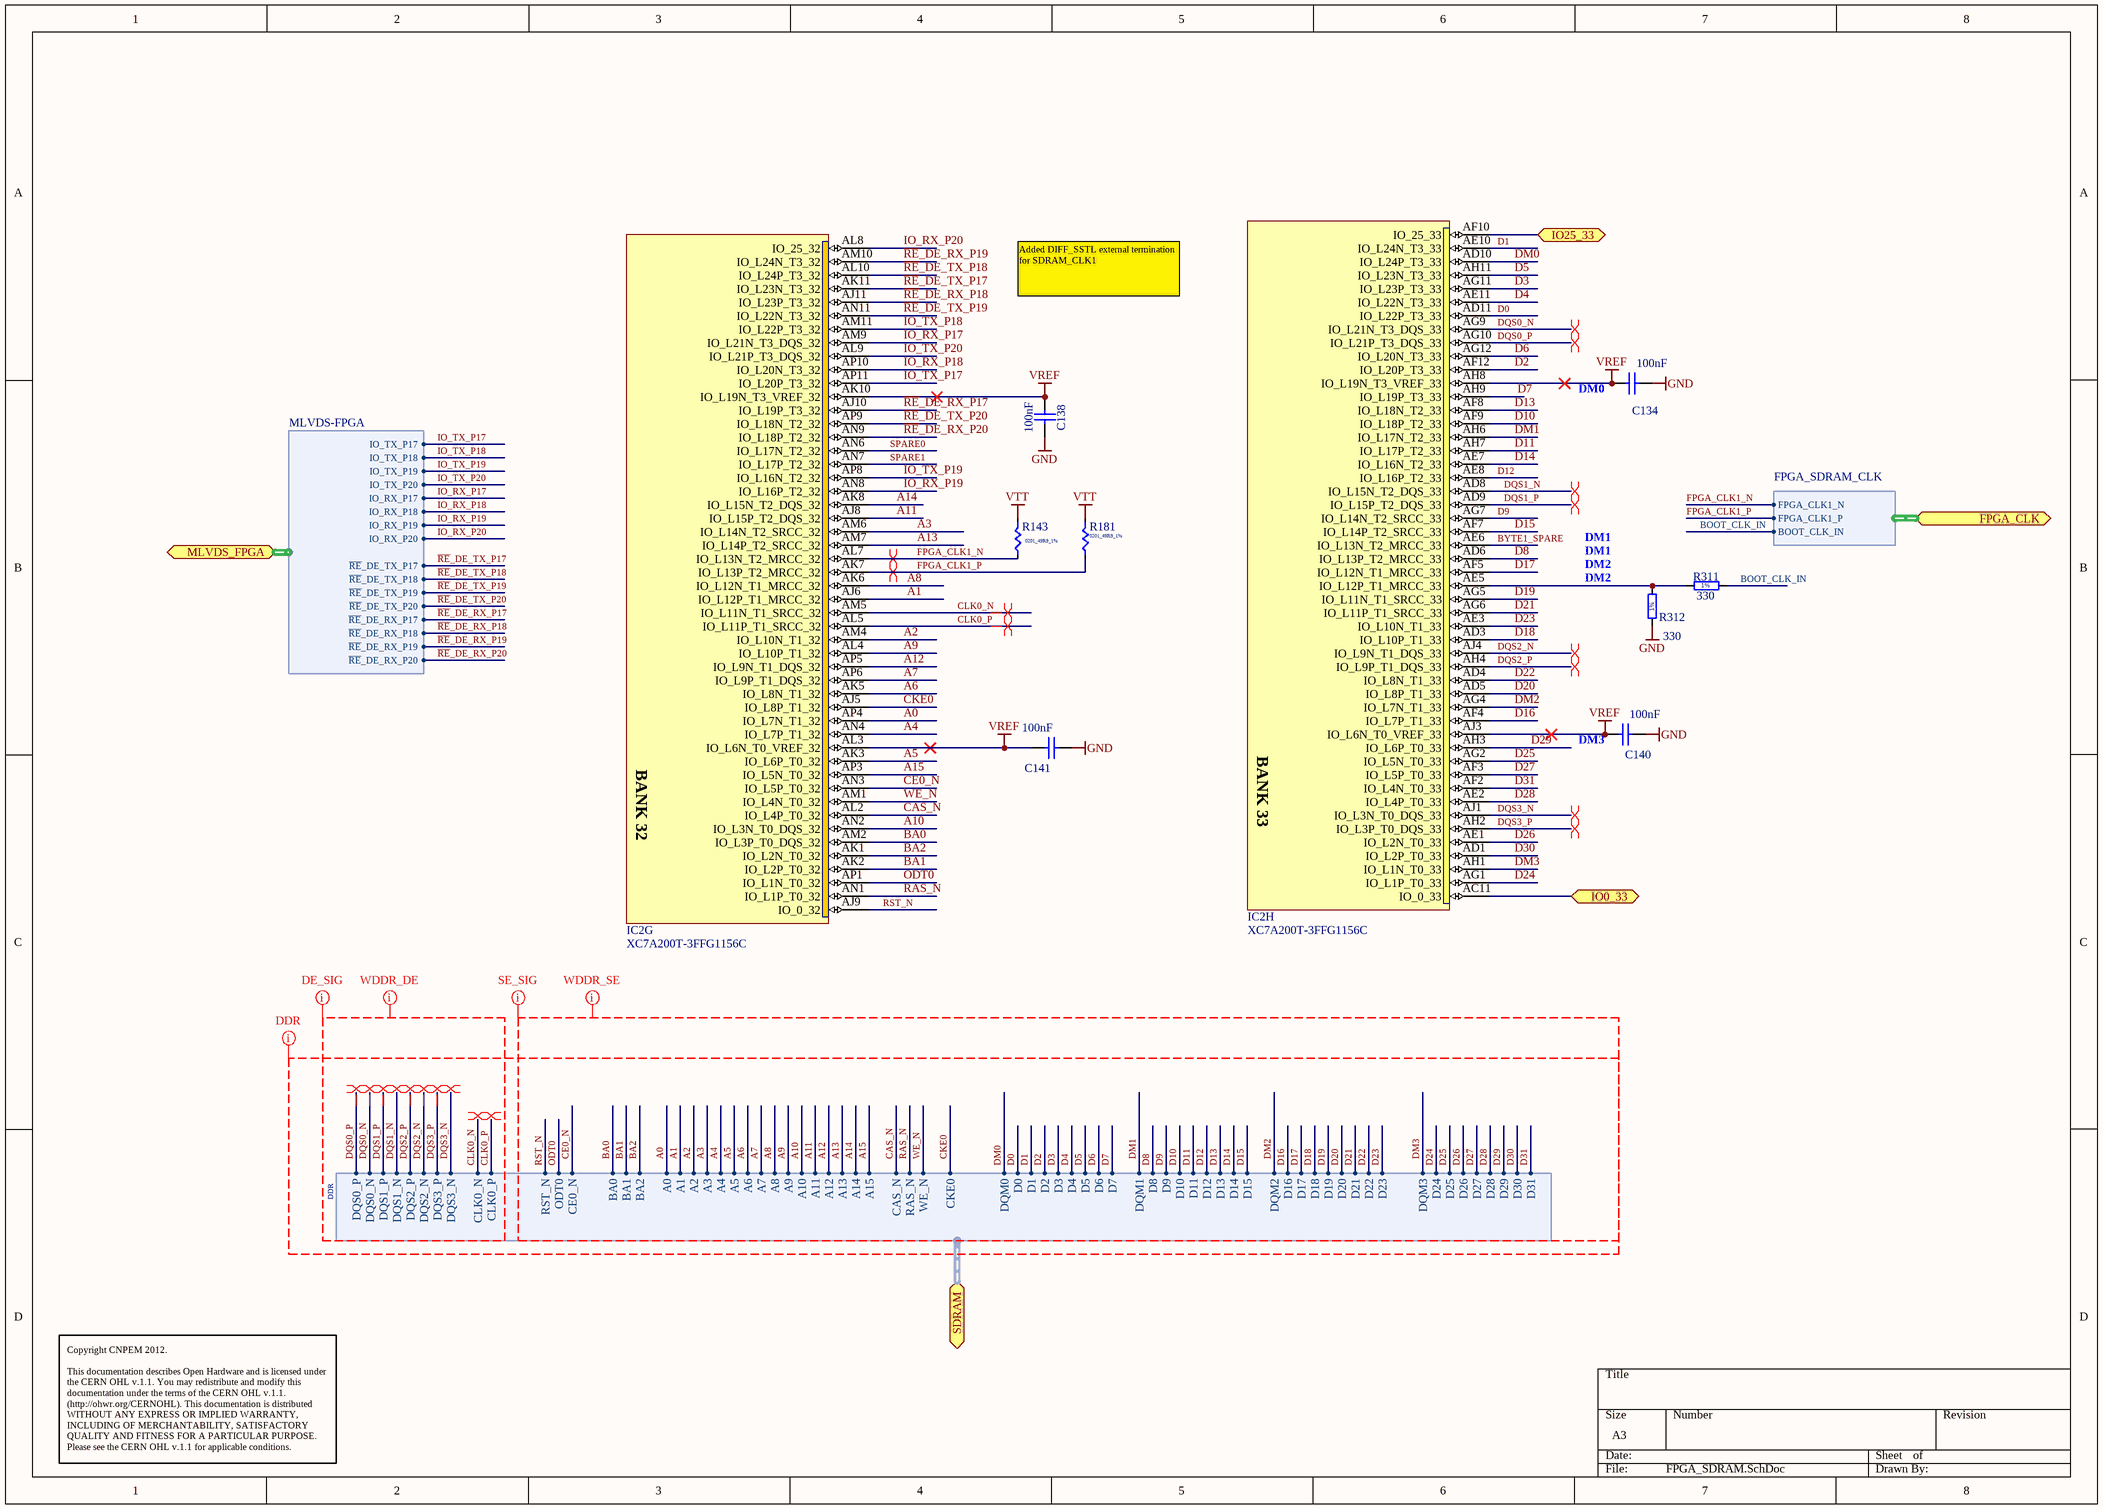
[diagram p5: FPGA_SDRAM.SchDoc]

### Parts
(Parts that share a designator on the sheet are numbered #1, #2 ... from top to bottom, then left to right.)
C134  100nF  [CAPC0603X33N]
C138  100nF  [CAPC0603X33N]
C140  100nF  [CAPC0603X33N]
C141  100nF  [CAPC0603X33N]
IC2#2  XC7A200T-3FFG1156C  [BGA1156C100P34X34_3500X3500X335]  (parts G,H of 23)
R143  0201_49R9_1%  [RESC0603X40N]
R181  0201_49R9_1%  [RESC0603X40N]
R311  330  [RESC1005X40N]
R312  330  [RESC1005X40N]

### Ports
FPGA_CLK (harness FPGA_SDRAM_CLK), IO0_33 (bidir), IO25_33 (bidir), MLVDS_FPGA (harness MLVDS-FPGA), SDRAM (harness DDR)

### Harnesses
DDR: CKE0, A0, A1, A2, A3, A4, A5, A7, A8, A9, A10, A11, A12, A13, BA0, BA1, BA2, A14, A15, CAS_N, RAS_N, WE_N, CE0_N, A6, D0, D1, D2, D3, D4, D5, D6, D7, D8, D9, D10, D11, D12, D13, D14, D15, CLK0_N, CLK0_P, ODT0, RST_N, D16, D17, D18, D19, D20, D21, D22, D23, D24, D25, D26, D27, D28, D29, D30, D31, DQS0_P, DQS1_P, DQS0_N, DQS1_N, DQS3_N, DQS3_P, DQS2_P, DQS2_N, DQM0, DQM1, DQM2, DQM3
MLVDS-FPGA: IO_TX_P17, IO_TX_P18, IO_TX_P19, IO_TX_P20, IO_RX_P17, IO_RX_P18, IO_RX_P19, IO_RX_P20, ~{RE}_DE_TX_P17, ~{RE}_DE_TX_P18, ~{RE}_DE_TX_P19, ~{RE}_DE_TX_P20, ~{RE}_DE_RX_P17, ~{RE}_DE_RX_P18, ~{RE}_DE_RX_P19, ~{RE}_DE_RX_P20
FPGA_SDRAM_CLK: FPGA_CLK1_N, FPGA_CLK1_P, BOOT_CLK_IN

### Nets
GND: C134.2 C138.2 C140.2 C141.2 R312.1
VREF: C134.1 C138.1 C140.1 C141.1 IC2#2.AH8(IO_L19N_T3_VREF_33) IC2#2.AJ3(IO_L6N_T0_VREF_33) IC2#2.AK10(IO_L19N_T3_VREF_32) IC2#2.AL3(IO_L6N_T0_VREF_32)
VTT: R143.1(+) R181.1(+)
A0: IC2#2.AP4(IO_L7N_T1_32) ; port SDRAM.A0  [project net FDDR.A0]
A1: IC2#2.AJ6(IO_L12P_T1_MRCC_32) ; port SDRAM.A1  [project net FDDR.A1]
A2: IC2#2.AM4(IO_L10N_T1_32) ; port SDRAM.A2  [project net FDDR.A2]
A3: IC2#2.AM6(IO_L14N_T2_SRCC_32) ; port SDRAM.A3  [project net FDDR.A3]
A4: IC2#2.AN4(IO_L7P_T1_32) ; port SDRAM.A4  [project net FDDR.A4]
A5: IC2#2.AK3(IO_L6P_T0_32) ; port SDRAM.A5  [project net FDDR.A5]
A6: IC2#2.AK5(IO_L8N_T1_32) ; port SDRAM.A6  [project net FDDR.A6]
A7: IC2#2.AP6(IO_L9P_T1_DQS_32) ; port SDRAM.A7  [project net FDDR.A7]
A8: IC2#2.AK6(IO_L12N_T1_MRCC_32) ; port SDRAM.A8  [project net FDDR.A8]
A9: IC2#2.AL4(IO_L10P_T1_32) ; port SDRAM.A9  [project net FDDR.A9]
A10: IC2#2.AN2(IO_L3N_T0_DQS_32) ; port SDRAM.A10  [project net FDDR.A10]
A11: IC2#2.AJ8(IO_L15P_T2_DQS_32) ; port SDRAM.A11  [project net FDDR.A11]
A12: IC2#2.AP5(IO_L9N_T1_DQS_32) ; port SDRAM.A12  [project net FDDR.A12]
A13: IC2#2.AM7(IO_L14P_T2_SRCC_32) ; port SDRAM.A13  [project net FDDR.A13]
A14: IC2#2.AK8(IO_L15N_T2_DQS_32) ; port SDRAM.A14  [project net FDDR.A14]
A15: IC2#2.AP3(IO_L5N_T0_32) ; port SDRAM.A15  [project net FDDR.A15]
BA0: IC2#2.AM2(IO_L3P_T0_DQS_32) ; port SDRAM.BA0  [project net FDDR.BA0]
BA1: IC2#2.AK2(IO_L2P_T0_32) ; port SDRAM.BA1  [project net FDDR.BA1]
BA2: IC2#2.AK1(IO_L2N_T0_32) ; port SDRAM.BA2  [project net FDDR.BA2]
BOOT_CLK_IN: R311.2 ; port FPGA_CLK.BOOT_CLK_IN  [project net FPGA_CLK.BOOT_CLK_IN]
BYTE1_SPARE: IC2#2.AE6(IO_L13N_T2_MRCC_33)
CAS_N: IC2#2.AL2(IO_L4P_T0_32) ; port SDRAM.CAS_N  [project net FDDR.CAS_N]
CE0_N: IC2#2.AN3(IO_L5P_T0_32) ; port SDRAM.CE0_N  [project net FDDR.CE0_N]
CKE0: IC2#2.AJ5(IO_L8P_T1_32) ; port SDRAM.CKE0  [project net FDDR.CKE0]
CLK0_N: IC2#2.AM5(IO_L11N_T1_SRCC_32) ; port SDRAM.CLK0_N  [project net FDDR.CLK0_N]
CLK0_P: IC2#2.AL5(IO_L11P_T1_SRCC_32) ; port SDRAM.CLK0_P  [project net FDDR.CLK0_P]
D0: IC2#2.AD11(IO_L22P_T3_33) ; port SDRAM.D0  [project net FDDR.D0]
D1: IC2#2.AE10(IO_L24N_T3_33) ; port SDRAM.D1  [project net FDDR.D1]
D2: IC2#2.AF12(IO_L20P_T3_33) ; port SDRAM.D2  [project net FDDR.D2]
D3: IC2#2.AG11(IO_L23P_T3_33) ; port SDRAM.D3  [project net FDDR.D3]
D4: IC2#2.AE11(IO_L22N_T3_33) ; port SDRAM.D4  [project net FDDR.D4]
D5: IC2#2.AH11(IO_L23N_T3_33) ; port SDRAM.D5  [project net FDDR.D5]
D6: IC2#2.AG12(IO_L20N_T3_33) ; port SDRAM.D6  [project net FDDR.D6]
D7: IC2#2.AH9(IO_L19P_T3_33) ; port SDRAM.D7  [project net FDDR.D7]
D8: IC2#2.AD6(IO_L13P_T2_MRCC_33) ; port SDRAM.D8  [project net FDDR.D8]
D9: IC2#2.AG7(IO_L14N_T2_SRCC_33) ; port SDRAM.D9  [project net FDDR.D9]
D10: IC2#2.AF9(IO_L18P_T2_33) ; port SDRAM.D10  [project net FDDR.D10]
D11: IC2#2.AH7(IO_L17P_T2_33) ; port SDRAM.D11  [project net FDDR.D11]
D12: IC2#2.AE8(IO_L16P_T2_33) ; port SDRAM.D12  [project net FDDR.D12]
D13: IC2#2.AF8(IO_L18N_T2_33) ; port SDRAM.D13  [project net FDDR.D13]
D14: IC2#2.AE7(IO_L16N_T2_33) ; port SDRAM.D14  [project net FDDR.D14]
D15: IC2#2.AF7(IO_L14P_T2_SRCC_33) ; port SDRAM.D15  [project net FDDR.D15]
D16: IC2#2.AF4(IO_L7P_T1_33) ; port SDRAM.D16  [project net FDDR.D16]
D17: IC2#2.AF5(IO_L12N_T1_MRCC_33) ; port SDRAM.D17  [project net FDDR.D17]
D18: IC2#2.AD3(IO_L10P_T1_33) ; port SDRAM.D18  [project net FDDR.D18]
D19: IC2#2.AG5(IO_L11N_T1_SRCC_33) ; port SDRAM.D19  [project net FDDR.D19]
D20: IC2#2.AD5(IO_L8P_T1_33) ; port SDRAM.D20  [project net FDDR.D20]
D21: IC2#2.AG6(IO_L11P_T1_SRCC_33) ; port SDRAM.D21  [project net FDDR.D21]
D22: IC2#2.AD4(IO_L8N_T1_33) ; port SDRAM.D22  [project net FDDR.D22]
D23: IC2#2.AE3(IO_L10N_T1_33) ; port SDRAM.D23  [project net FDDR.D23]
D24: IC2#2.AG1(IO_L1P_T0_33) ; port SDRAM.D24  [project net FDDR.D24]
D25: IC2#2.AG2(IO_L5N_T0_33) ; port SDRAM.D25  [project net FDDR.D25]
D26: IC2#2.AE1(IO_L2N_T0_33) ; port SDRAM.D26  [project net FDDR.D26]
D27: IC2#2.AF3(IO_L5P_T0_33) ; port SDRAM.D27  [project net FDDR.D27]
D28: IC2#2.AE2(IO_L4P_T0_33) ; port SDRAM.D28  [project net FDDR.D28]
D29: IC2#2.AH3(IO_L6P_T0_33) ; port SDRAM.D29  [project net FDDR.D29]
D30: IC2#2.AD1(IO_L2P_T0_33) ; port SDRAM.D30  [project net FDDR.D30]
D31: IC2#2.AF2(IO_L4N_T0_33) ; port SDRAM.D31  [project net FDDR.D31]
DM0: IC2#2.AD10(IO_L24P_T3_33) ; port SDRAM.DQM0  [project net FDDR.DQM0]
DM1: IC2#2.AH6(IO_L17N_T2_33) ; port SDRAM.DQM1  [project net FDDR.DQM1]
DM2: IC2#2.AG4(IO_L7N_T1_33) ; port SDRAM.DQM2  [project net FDDR.DQM2]
DM3: IC2#2.AH1(IO_L1N_T0_33) ; port SDRAM.DQM3  [project net FDDR.DQM3]
DQS0_N: IC2#2.AG9(IO_L21N_T3_DQS_33) ; port SDRAM.DQS0_N  [project net FDDR.DQS0_N]
DQS0_P: IC2#2.AG10(IO_L21P_T3_DQS_33) ; port SDRAM.DQS0_P  [project net FDDR.DQS0_P]
DQS1_N: IC2#2.AD8(IO_L15N_T2_DQS_33) ; port SDRAM.DQS1_N  [project net FDDR.DQS1_N]
DQS1_P: IC2#2.AD9(IO_L15P_T2_DQS_33) ; port SDRAM.DQS1_P  [project net FDDR.DQS1_P]
DQS2_N: IC2#2.AJ4(IO_L9N_T1_DQS_33) ; port SDRAM.DQS2_N  [project net FDDR.DQS2_N]
DQS2_P: IC2#2.AH4(IO_L9P_T1_DQS_33) ; port SDRAM.DQS2_P  [project net FDDR.DQS2_P]
DQS3_N: IC2#2.AJ1(IO_L3N_T0_DQS_33) ; port SDRAM.DQS3_N  [project net FDDR.DQS3_N]
DQS3_P: IC2#2.AH2(IO_L3P_T0_DQS_33) ; port SDRAM.DQS3_P  [project net FDDR.DQS3_P]
FPGA_CLK1_N: IC2#2.AL7(IO_L13N_T2_MRCC_32) R143.2(-) ; port FPGA_CLK.FPGA_CLK1_N  [project net FPGA_CLK.FPGA_CLK1_N]
FPGA_CLK1_P: IC2#2.AK7(IO_L13P_T2_MRCC_32) R181.2(-) ; port FPGA_CLK.FPGA_CLK1_P  [project net FPGA_CLK.FPGA_CLK1_P]
IO0_33: IC2#2.AC11(IO_0_33) ; port IO0_33
IO25_33: IC2#2.AF10(IO_25_33) ; port IO25_33
IO_RX_P17: IC2#2.AM9(IO_L21N_T3_DQS_32) ; port MLVDS_FPGA.IO_RX_P17  [project net MLVDS_F.IO_RX_P17]
IO_RX_P18: IC2#2.AP10(IO_L20N_T3_32) ; port MLVDS_FPGA.IO_RX_P18  [project net MLVDS_F.IO_RX_P18]
IO_RX_P19: IC2#2.AN8(IO_L16P_T2_32) ; port MLVDS_FPGA.IO_RX_P19  [project net MLVDS_F.IO_RX_P19]
IO_RX_P20: IC2#2.AL8(IO_25_32) ; port MLVDS_FPGA.IO_RX_P20  [project net MLVDS_F.IO_RX_P20]
IO_TX_P17: IC2#2.AP11(IO_L20P_T3_32) ; port MLVDS_FPGA.IO_TX_P17  [project net MLVDS_F.IO_TX_P17]
IO_TX_P18: IC2#2.AM11(IO_L22P_T3_32) ; port MLVDS_FPGA.IO_TX_P18  [project net MLVDS_F.IO_TX_P18]
IO_TX_P19: IC2#2.AP8(IO_L16N_T2_32) ; port MLVDS_FPGA.IO_TX_P19  [project net MLVDS_F.IO_TX_P19]
IO_TX_P20: IC2#2.AL9(IO_L21P_T3_DQS_32) ; port MLVDS_FPGA.IO_TX_P20  [project net MLVDS_F.IO_TX_P20]
ODT0: IC2#2.AP1(IO_L1N_T0_32) ; port SDRAM.ODT0  [project net FDDR.ODT0]
~{RE}_DE_RX_P17: IC2#2.AJ10(IO_L19P_T3_32) ; port MLVDS_FPGA.~{RE}_DE_RX_P17  [project net MLVDS_F.~{RE}_DE_RX_P17]
~{RE}_DE_RX_P18: IC2#2.AJ11(IO_L23P_T3_32) ; port MLVDS_FPGA.~{RE}_DE_RX_P18  [project net MLVDS_F.~{RE}_DE_RX_P18]
~{RE}_DE_RX_P19: IC2#2.AM10(IO_L24N_T3_32) ; port MLVDS_FPGA.~{RE}_DE_RX_P19  [project net MLVDS_F.~{RE}_DE_RX_P19]
~{RE}_DE_RX_P20: IC2#2.AN9(IO_L18P_T2_32) ; port MLVDS_FPGA.~{RE}_DE_RX_P20  [project net MLVDS_F.~{RE}_DE_RX_P20]
~{RE}_DE_TX_P17: IC2#2.AK11(IO_L23N_T3_32) ; port MLVDS_FPGA.~{RE}_DE_TX_P17  [project net MLVDS_F.~{RE}_DE_TX_P17]
~{RE}_DE_TX_P18: IC2#2.AL10(IO_L24P_T3_32) ; port MLVDS_FPGA.~{RE}_DE_TX_P18  [project net MLVDS_F.~{RE}_DE_TX_P18]
~{RE}_DE_TX_P19: IC2#2.AN11(IO_L22N_T3_32) ; port MLVDS_FPGA.~{RE}_DE_TX_P19  [project net MLVDS_F.~{RE}_DE_TX_P19]
~{RE}_DE_TX_P20: IC2#2.AP9(IO_L18N_T2_32) ; port MLVDS_FPGA.~{RE}_DE_TX_P20  [project net MLVDS_F.~{RE}_DE_TX_P20]
RAS_N: IC2#2.AN1(IO_L1P_T0_32) ; port SDRAM.RAS_N  [project net FDDR.RAS_N]
RST_N: IC2#2.AJ9(IO_0_32) ; port SDRAM.RST_N  [project net FDDR.RST_N]
SPARE0: IC2#2.AN6(IO_L17N_T2_32)
SPARE1: IC2#2.AN7(IO_L17P_T2_32)
WE_N: IC2#2.AM1(IO_L4N_T0_32) ; port SDRAM.WE_N  [project net FDDR.WE_N]
NetIC2#2_AE5: IC2#2.AE5(IO_L12P_T1_MRCC_33) R311.1 R312.2

### Layout directives
differential pair: FDDR.CLK0_N, FDDR.CLK0_P, FDDR.DQS0_N, FDDR.DQS0_P, FDDR.DQS1_N, FDDR.DQS1_P, FDDR.DQS2_N, FDDR.DQS2_P, FDDR.DQS3_N, FDDR.DQS3_P, FPGA_CLK.FPGA_CLK1_N, FPGA_CLK.FPGA_CLK1_P
net class DDR: A0, A1, A2, A3, A4, A5, A6, A7, A8, A9, A10, A11, A12, A13, A14, A15, BA0, BA1, BA2, CAS_N, CE0_N, CKE0, CLK0_N, CLK0_P, D0, D1, D2, D3, D4, D5, D6, D7, D8, D9, D10, D11, D12, D13, D14, D15, D16, D17, D18, D19, D20, D21, D22, D23, D24, D25, D26, D27, D28, D29, D30, D31, DM0, DM1, DM2, DM3, DQS0_N, DQS0_P, DQS1_N, DQS1_P, DQS2_N, DQS2_P, DQS3_N, DQS3_P, ODT0, RAS_N, RST_N, WE_N
net class DE_SIG: CLK0_N, CLK0_P, DQS0_N, DQS0_P, DQS1_N, DQS1_P, DQS2_N, DQS2_P, DQS3_N, DQS3_P
net class SE_SIG: A0, A1, A2, A3, A4, A5, A6, A7, A8, A9, A10, A11, A12, A13, A14, A15, BA0, BA1, BA2, CAS_N, CE0_N, CKE0, D0, D1, D2, D3, D4, D5, D6, D7, D8, D9, D10, D11, D12, D13, D14, D15, D16, D17, D18, D19, D20, D21, D22, D23, D24, D25, D26, D27, D28, D29, D30, D31, DM0, DM1, DM2, DM3, ODT0, RAS_N, RST_N, WE_N
net class WDDR_DE: CLK0_N, CLK0_P, DQS0_N, DQS0_P, DQS1_N, DQS1_P, DQS2_N, DQS2_P, DQS3_N, DQS3_P
net class WDDR_SE: A0, A1, A2, A3, A4, A5, A6, A7, A8, A9, A10, A11, A12, A13, A14, A15, BA0, BA1, BA2, CAS_N, CE0_N, CKE0, D0, D1, D2, D3, D4, D5, D6, D7, D8, D9, D10, D11, D12, D13, D14, D15, D16, D17, D18, D19, D20, D21, D22, D23, D24, D25, D26, D27, D28, D29, D30, D31, DM0, DM1, DM2, DM3, ODT0, RAS_N, RST_N, WE_N

### Notes on the sheet
- Added DIFF_SSTL external termination for SDRAM_CLK1
- (near C134) DM0
- DM1
- (near R312) DM2
- (near C140) DM3
- Copyright CNPEM 2012.
  This documentation describes Open Hardware and is licensed under the CERN OHL v.1.1. You may redistribute and modify this documentation under the terms of the CERN OHL v.1.1. (http://ohwr.org/CERNOHL). This documentation is distributed WITHOUT ANY EXPRESS OR IMPLIED WARRANTY, INCLUDING OF MERCHANTABILITY, SATISFACTORY QUALITY AND FITNESS FOR A PARTICULAR PURPOSE. Please see the CERN OHL v.1.1 for applicable conditions.
- (in symbol R0402_330R_1%_0.0625W_100PPM) 1%
- (in symbol XC7A200T-3FFG1156C, part G) BANK 32
- (in symbol XC7A200T-3FFG1156C, part H) BANK 33
- (in symbol XC7A350T-2FFG1156C, part G) BANK 32
- (in symbol XC7A350T-2FFG1156C, part H) BANK 33

### Library data of the parts
C134 C138 C140 C141 = CC0201_100NF_6.3V_10%_X5R: as C398 on sheet FPGA; Part Number: CC0201_100NF_6.3V_10%_X5R; Component Kind: Standard; Component Type: Standard; Pin Count: 2; Value: 100nF; Status: Not Recommended; Manufacturer Part Number: CC0201_100NF_6.3V_10%_X5R; Case: 0201; Mounted: Yes; Socket: No; SMD: Yes; Manufacturer1 Example: AVX; Manufacturer1 ComponentHeight: 0.33mm; HelpURL: \\cern.ch\dfs\Applications\Altium\Datasheets\CC0201_X5R_AVX.pdf; Author: CERN DEM JLC; CreateDate: 2007-12-03; LatestRevisionDate: 2007-12-03
IC2#2 = XC7A200T-3FFG1156C: Artix-6 FPGA, 16 GTPs, 600 User I/Os, 1156-Pin BGA, Speed Grade 2, Commercial Grade, Pb-Free; Part Description: Artix-7 FPGA, 16 GTPs, 600 User I/Os, 1156-Pin BGA, Speed Grade 2, Commercial Grade, Pb-Free; Manufacturer: XILINX; Table: Logic; Part Number: XC7A200T-3FFG1156C; Component Kind: Standard; Component Type: Standard; Device: XC7A200T-3FFG1156C; PackageDescription: BGA, 1.00mm Pitch, Square; 1156 Pin, 34 Columns X 34 Rows, 35.00mm X 35.00mm X 3.350mm H; Manufacturer Part Number: XC7A200T-3FFG1156C; Pin Count: 1156; Case: BGA1156; Mounted: Yes; Socket: No; SMD: Yes; ComponentHeight: 3.35mm; HelpURL: \\cern.ch\dfs\Applications\Altium\Datasheets\XC7A350T-2FFG1156C.pdf; ComponentLink1URL: \\cern.ch\dfs\Applications\Altium\Datasheets\XC7A350T-2FFG1156C.pdf; ComponentLink1Description: Package/Pinout; Author: CERN DEM JLC; CreateDate: 2012-09-19; LatestRevisionDate: 2012-09-19
R143 R181 = SMT_0402_0201: MiscInfo: Biggest Cern Footprint [max height]; Document Name: FPGA_SDRAM.SchDoc; Part Number: SMT_0402_0201; FootprintSizeX (mm): 1.8; FootprintSizeY (mm): 0.9; FootprintRectangleArea (mm): 1.62; Thickness (Max) (mm): 0.4; FootprintAlias: 0402
R311 R312 = R0402_330R_1%_0.0625W_100PPM: as R132 on sheet FPGA; Part Number: R0402_330R_1%_0.0625W_100PPM; Component Kind: Standard; Component Type: Standard; Pin Count: 2; Value: 330; Status: Not recommended; Power: 0.0625W; Tolerance: ±1%; Manufacturer Part Number: R0402_330R_1%_0.0625W_100PPM; Case: 0402; Mounted: Yes; Socket: No; SMD: Yes; Manufacturer1 Example: YAGEO PHYCOMP; Manufacturer1 ComponentHeight: 0.4mm; HelpURL: \\cern.ch\dfs\Applications\Altium\Datasheets\R0402_Phycomp_RC0402.pdf; Author: CERN DEM JLC; CreateDate: 2007-12-03; LatestRevisionDate: 2012-10-17